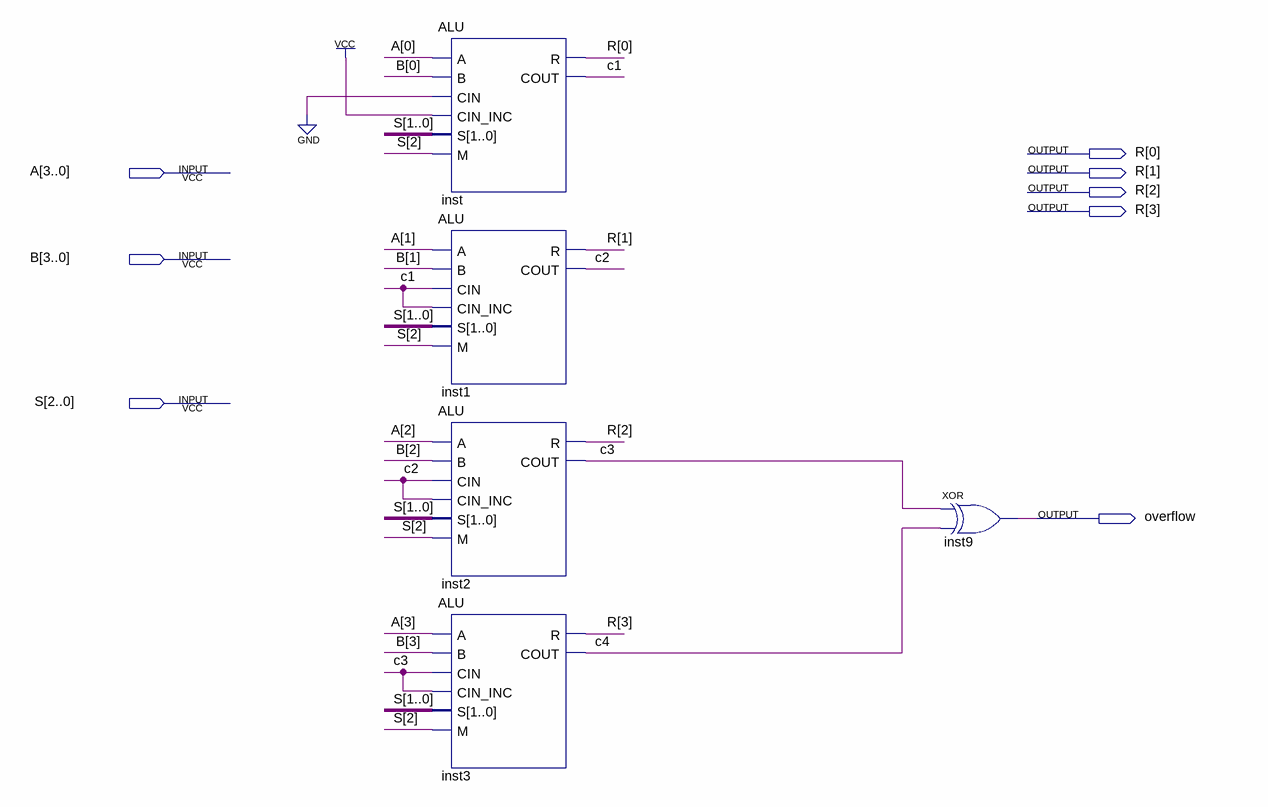
[diagram p0: schematic sheet]
// Quartus schematic ALU4_bit.bdf as structural Verilog: 5 symbols, 8 pins
module ALU4_bit (
  input  [3:0] A,
  input  [3:0] B,
  input  [2:0] S,
  output [3:0] R,
  output overflow
);

  wire c1, c2, c3, c4;

  ALU inst (.A(A[0]), .B(B[0]), .CIN(1'b0), .CIN_INC(1'b1), .S(S[1:0]), .M(S[2]), .R(R[0]), .COUT(c1));
  ALU inst1 (.A(A[1]), .B(B[1]), .CIN(c1), .CIN_INC(c1), .S(S[1:0]), .M(S[2]), .R(R[1]), .COUT(c2));
  ALU inst2 (.A(A[2]), .B(B[2]), .CIN(c2), .CIN_INC(c2), .S(S[1:0]), .M(S[2]), .R(R[2]), .COUT(c3));
  ALU inst3 (.A(A[3]), .B(B[3]), .CIN(c3), .CIN_INC(c3), .S(S[1:0]), .M(S[2]), .R(R[3]), .COUT(c4));
  xor inst9 (overflow, c3, c4);
endmodule
